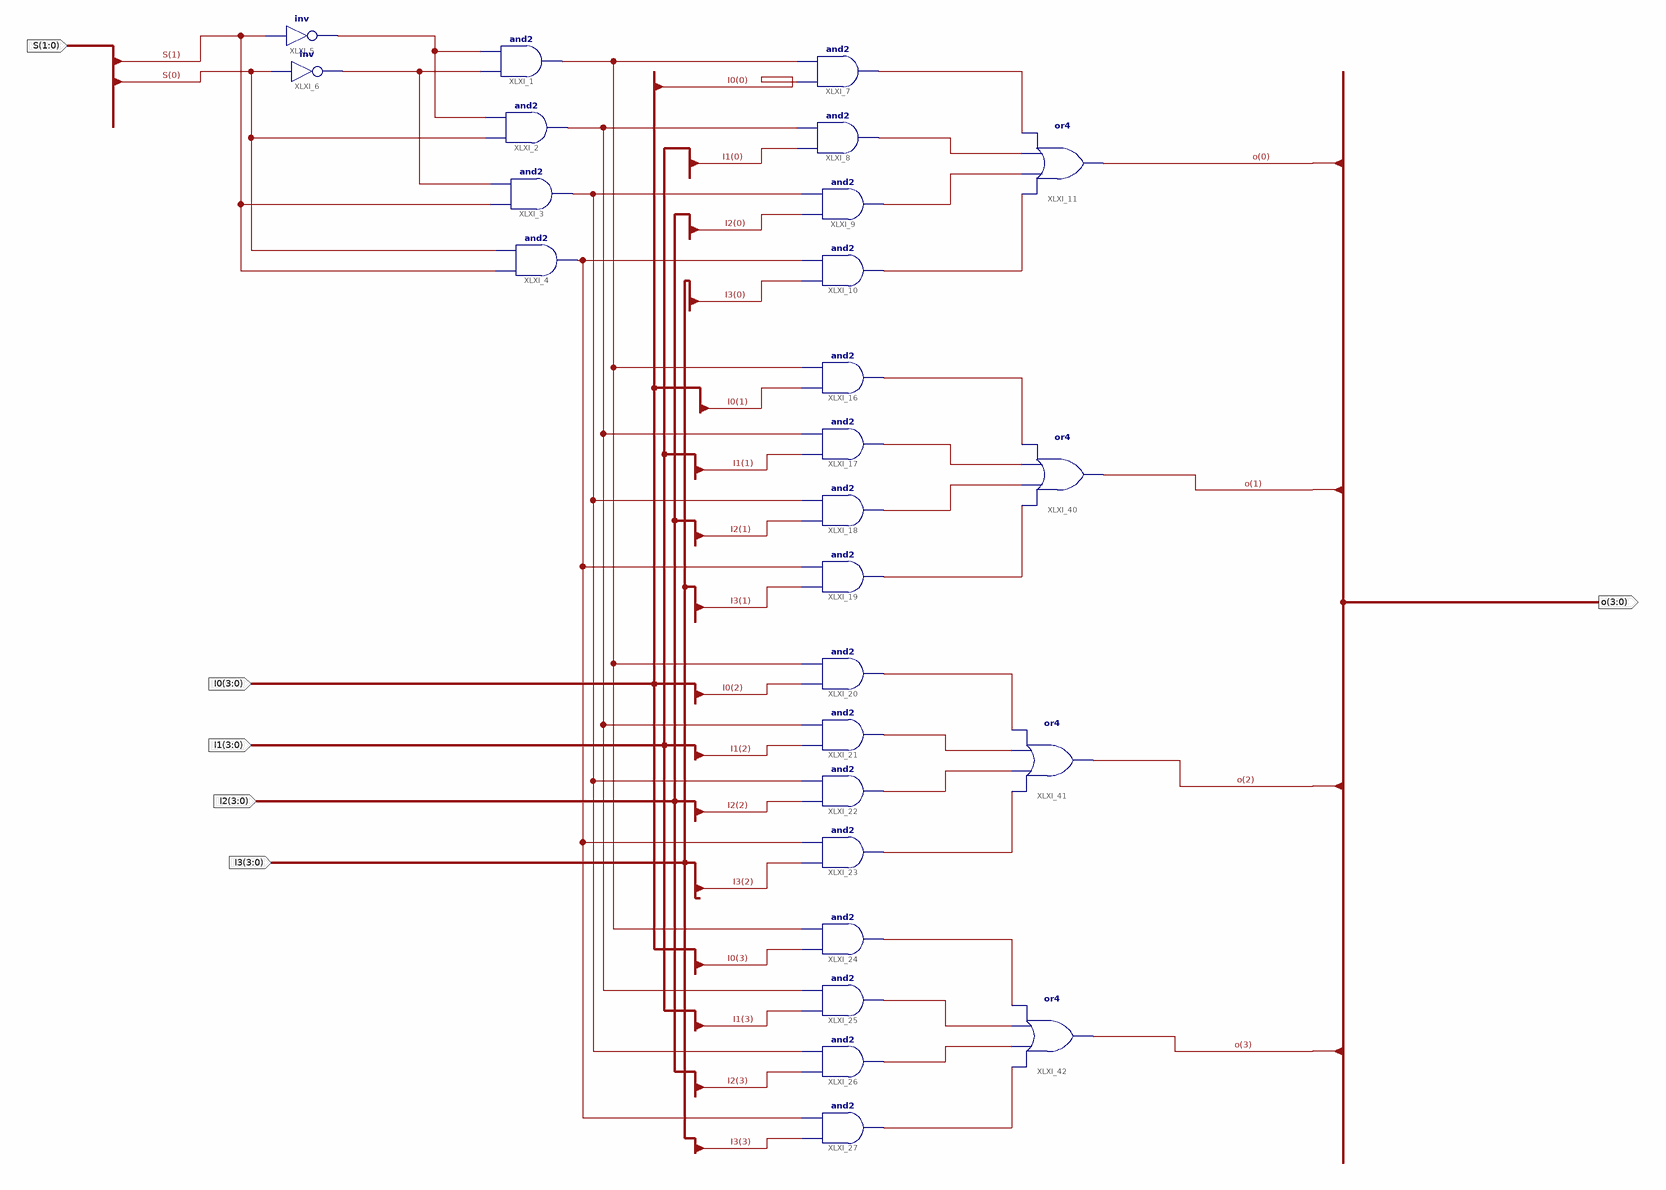
[diagram p0: schematic sheet 1]
// Xilinx ISE schematic Mux4to14b.sch (kintex7) as structural Verilog: 26 symbols, 6 ports
module Mux4to14b (
  input  [1:0] S,
  input  [3:0] I3,
  input  [3:0] I2,
  input  [3:0] I1,
  input  [3:0] I0,
  output [3:0] o
);

  wire XLXN_3, XLXN_4, XLXN_25, XLXN_44, XLXN_45, XLXN_47, XLXN_56, XLXN_57, XLXN_58, XLXN_59, XLXN_60,
       XLXN_61, XLXN_62, XLXN_63, XLXN_64, XLXN_65, XLXN_66, XLXN_67, XLXN_68, XLXN_69, XLXN_70, XLXN_71;

  and XLXI_1 (XLXN_44, XLXN_4, XLXN_3);
  and XLXI_2 (XLXN_45, S[0], XLXN_3);
  and XLXI_3 (XLXN_25, S[1], XLXN_4);
  and XLXI_4 (XLXN_47, S[1], S[0]);
  not XLXI_5 (XLXN_3, S[1]);
  not XLXI_6 (XLXN_4, S[0]);
  and XLXI_7 (XLXN_56, I0[0], XLXN_44);
  and XLXI_8 (XLXN_57, I1[0], XLXN_45);
  and XLXI_9 (XLXN_58, I2[0], XLXN_25);
  and XLXI_10 (XLXN_59, I3[0], XLXN_47);
  or XLXI_11 (o[0], XLXN_59, XLXN_58, XLXN_57, XLXN_56);
  and XLXI_16 (XLXN_60, I0[1], XLXN_44);
  and XLXI_17 (XLXN_61, I1[1], XLXN_45);
  and XLXI_18 (XLXN_62, I2[1], XLXN_25);
  and XLXI_19 (XLXN_63, I3[1], XLXN_47);
  and XLXI_20 (XLXN_64, I0[2], XLXN_44);
  and XLXI_21 (XLXN_65, I1[2], XLXN_45);
  and XLXI_22 (XLXN_66, I2[2], XLXN_25);
  and XLXI_23 (XLXN_67, I3[2], XLXN_47);
  and XLXI_24 (XLXN_68, I0[3], XLXN_44);
  and XLXI_25 (XLXN_69, I1[3], XLXN_45);
  and XLXI_26 (XLXN_70, I2[3], XLXN_25);
  and XLXI_27 (XLXN_71, I3[3], XLXN_47);
  or XLXI_40 (o[1], XLXN_63, XLXN_62, XLXN_61, XLXN_60);
  or XLXI_41 (o[2], XLXN_67, XLXN_66, XLXN_65, XLXN_64);
  or XLXI_42 (o[3], XLXN_71, XLXN_70, XLXN_69, XLXN_68);
endmodule
